# EAGLE design Barmaley (EAGLE 7.5.0)
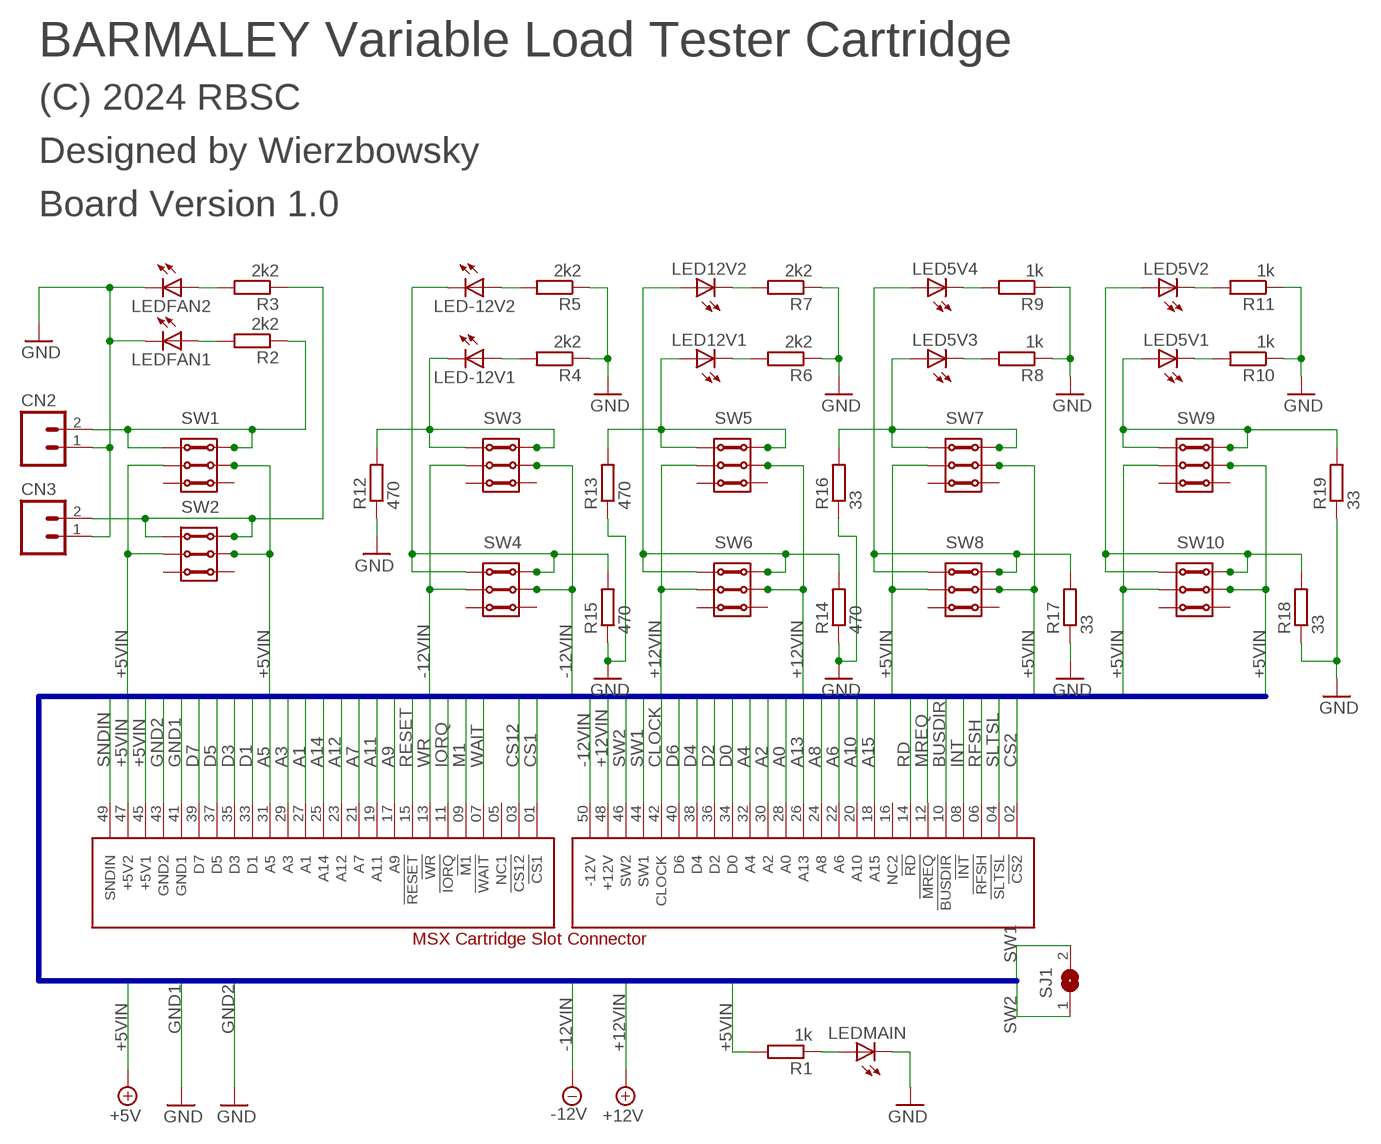
[diagram p0: schematic, sheet 1]

## Parts
CN1  SLOTCONN  MSX_SLOT_CON  [MSX_SLOT_CON]
CN2  2-PIN_FAN_CONNECTOR  [MOLEX-X2]
CN3  2-PIN_FAN_CONNECTOR  [MOLEX-X2]
LED5V1  LEDSQR2X5  [LED2X5]
LED5V2  LEDSQR2X5  [LED2X5]
LED5V3  LEDSQR2X5  [LED2X5]
LED5V4  LEDSQR2X5  [LED2X5]
LED12V1  LEDSQR2X5  [LED2X5]
LED12V2  LEDSQR2X5  [LED2X5]
LED-12V1  LEDSQR2X5  [LED2X5]
LED-12V2  LEDSQR2X5  [LED2X5]
LEDFAN1  LEDSQR2X5  [LED2X5]
LEDFAN2  LEDSQR2X5  [LED2X5]
LEDMAIN  LED5MM  [LED5MM]
R1  1k  R-EU_R0805  [R0805]
R2  2k2  R-EU_R0805  [R0805]
R3  2k2  R-EU_R0805  [R0805]
R4  2k2  R-EU_R0805  [R0805]
R5  2k2  R-EU_R0805  [R0805]
R6  2k2  R-EU_R0805  [R0805]
R7  2k2  R-EU_R0805  [R0805]
R8  1k  R-EU_R0805  [R0805]
R9  1k  R-EU_R0805  [R0805]
R10  1k  R-EU_R0805  [R0805]
R11  1k  R-EU_R0805  [R0805]
R12  470  R-EU_0617/22  [0617/22]
R13  470  R-EU_0617/22  [0617/22]
R14  470  R-EU_0617/22  [0617/22]
R15  470  R-EU_0617/22  [0617/22]
R16  33  R-EU_0617/22  [0617/22]
R17  33  R-EU_0617/22  [0617/22]
R18  33  R-EU_0617/22  [0617/22]
R19  33  R-EU_0617/22  [0617/22]
SJ1  SJ  [SJ]
SW1  2-POSITION_SWITCH  [2PSW]
SW2  2-POSITION_SWITCH  [2PSW]
SW3  2-POSITION_SWITCH  [2PSW]
SW4  2-POSITION_SWITCH  [2PSW]
SW5  2-POSITION_SWITCH  [2PSW]
SW6  2-POSITION_SWITCH  [2PSW]
SW7  2-POSITION_SWITCH  [2PSW]
SW8  2-POSITION_SWITCH  [2PSW]
SW9  2-POSITION_SWITCH  [2PSW]
SW10  2-POSITION_SWITCH  [2PSW]

## Nets
+5VIN: CN1.45(+5V1) CN1.47(+5V2) R1.2 SW1.2.1 SW1.2.2 SW2.2.1 SW2.2.2 SW7.2.1 SW7.2.2 SW8.2.1 SW8.2.2 SW9.2.1 SW9.2.2 SW10.2.1 SW10.2.2 ; supply symbol labelled +5V
+12VIN: CN1.48(+12V) SW5.2.1 SW5.2.2 SW6.2.1 SW6.2.2 ; supply symbol labelled +12V
-12VIN: CN1.50(-12V) SW3.2.1 SW3.2.2 SW4.2.1 SW4.2.2 ; supply symbol labelled -12V
A0: CN1.28(A0)
A1: CN1.27(A1)
A2: CN1.30(A2)
A3: CN1.29(A3)
A4: CN1.32(A4)
A5: CN1.31(A5)
A6: CN1.22(A6)
A7: CN1.21(A7)
A8: CN1.24(A8)
A9: CN1.17(A9)
A10: CN1.20(A10)
A11: CN1.19(A11)
A12: CN1.23(A12)
A13: CN1.26(A13)
A14: CN1.25(A14)
A15: CN1.18(A15)
BUSDIR: CN1.10(!BUSDIR)
CLOCK: CN1.42(CLOCK)
CS1: CN1.01(!CS1)
CS2: CN1.02(!CS2)
CS12: CN1.03(!CS12)
D0: CN1.34(D0)
D1: CN1.33(D1)
D2: CN1.36(D2)
D3: CN1.35(D3)
D4: CN1.38(D4)
D5: CN1.37(D5)
D6: CN1.40(D6)
D7: CN1.39(D7)
GND: CN2.1 CN3.1 LEDFAN1.K(C) LEDFAN2.K(C) LEDMAIN.K(C) R4.1 R5.1 R6.1 R7.1 R8.1 R9.1 R10.1 R11.1 R12.1 R13.1 R14.1 R15.1 R16.1 R17.1 R18.1 R19.1
GND1: CN1.41(GND1) ; supply symbol labelled GND
GND2: CN1.43(GND2) ; supply symbol labelled GND
GND3: LED-12V1.K(C) R12.2 SW3.3.1 SW3.3.2
GND4: LED-12V2.K(C) R15.2 SW4.3.1 SW4.3.2
INT: CN1.08(!INT)
IORQ: CN1.11(!IORQ)
M1: CN1.09(!M1)
MREQ: CN1.12(!MREQ)
N$1: LEDMAIN.A R1.1
N$2: CN2.2 R2.1 SW1.3.1 SW1.3.2
N$4: CN3.2 R3.1 SW2.3.1 SW2.3.2
N$5: LEDFAN1.A R2.2
N$6: LEDFAN2.A R3.2
N$7: LED-12V1.A R4.2
N$8: LED-12V2.A R5.2
N$9: LED12V1.K(C) R6.2
N$10: LED12V2.K(C) R7.2
N$11: LED5V4.K(C) R9.2
N$12: LED5V3.K(C) R8.2
N$13: LED5V1.K(C) R10.2
N$14: LED5V2.K(C) R11.2
N$15: LED12V1.A R13.2 SW5.3.1 SW5.3.2
N$16: LED12V2.A R14.2 SW6.3.1 SW6.3.2
N$19: LED5V4.A R17.2 SW8.3.1 SW8.3.2
N$21: LED5V3.A R16.2 SW7.3.1 SW7.3.2
N$22: LED5V1.A R19.2 SW9.3.1 SW9.3.2
N$24: LED5V2.A R18.2 SW10.3.1 SW10.3.2
RD: CN1.14(!RD)
RESET: CN1.15(!RESET)
RFSH: CN1.06(!RFSH)
SLTSL: CN1.04(!SLTSL)
SNDIN: CN1.49(SNDIN)
SW1: CN1.44(SW1) SJ1.2
SW2: CN1.46(SW2) SJ1.1
WAIT: CN1.07(!WAIT)
WR: CN1.13(!WR)
Unconnected: CN1.05(NC1) CN1.16(NC2) SW1.1.1 SW1.1.2 SW2.1.1 SW2.1.2 SW3.1.1 SW3.1.2 SW4.1.1 SW4.1.2 SW5.1.1 SW5.1.2 SW6.1.1 SW6.1.2 SW7.1.1 SW7.1.2 SW8.1.1 SW8.1.2 SW9.1.1 SW9.1.2 SW10.1.1 SW10.1.2

## Buses
D0,D1,D2,D3,D4,D5,D6,D7,A0,A1,A2,A3,A4,A5,A6,A7,A8,A9,A10,A11,A12,A13,A14,A15,SLTSL,RFSH,WAIT,INT,M1,BUSDIR,IORQ,MERQ,WR,RD,RESET,GND,CLOCK,SW1,SW2,CS1,CS2,CS12,SNDIN,GND1,GND2,+5V1,+5V2,+12V,-12V,+5VIN,+5VOUT,+12VIN,+12VOUT,-12VIN,-12VOUT,MREQ

## Notes on the sheet
- BARMALEY Variable Load Tester Cartridge
- (C) 2024 RBSC
- Designed by Wierzbowsky
- Board Version 1.0

## Library data of the parts
CN1 = msx_edge_conn:MSX_SLOT_CON
CN2 CN3 = fan_conn:2-PIN_FAN_CONNECTOR: 2-pin fan connector
LED5V1-LED5V4 LED12V1 LED12V2 LED-12V1 LED-12V2 LEDFAN1 LEDFAN2 LEDMAIN = led:LED: LED OSRAM: - CHIPLED LG R971, LG N971, LY N971, LG Q971, LY Q971, LO R971, LY R971 LH N974, LH R974 LS Q976, LO Q976, LY Q976 LO Q996 - Hyper CHIPLED LW Q18S LB Q993, LB Q99A, LB R99A - SideLED LS A670, LO A670, LY A670, LG A670, LP A670 LB A673, LV A673, LT A673, LW A673 LH A674 LY A675 LS A676, LA A676, LO A676, LY A676, LW A676 LS A679, LY A679, LG A679 - Hyper Micro SIDELED® LS Y876, LA Y876, LO Y876, LY Y876 LT Y87S - SmartLED LW L88C, LW L88S LB L89C, LB L89S, LG L890 LS L89K, LO L89K, LY L89K LS L896, LA L896, LO L896, LY L896 - TOPLED LS T670, LO T670, LY T670, LG T670, LP T670 LSG T670, LSP T670, LSY T670, LOP T670, LYG T670 LG T671, LOG T671, LSG T671 LB T673, LV T673, LT T673, LW T673 LH T674 LS T676, LA T676, LO T676, LY T676, LB T676, LH T676, LSB T676, LW T676 LB T67C, LV T67C, LT T67C, LS T67K, LO T67K, LY T67K, LW E67C LS E67B, LA E67B, LO E67B, LY E67B, LB E67C, LV E67C, LT E67C LW T67C LS T679, LY T679, LG T679 LS T770, LO T770, LY T770, LG T770, LP T770 LB T773, LV T773, LT T773, LW T773 LH T774 LS E675, LA E675, LY E675, LS T675 LS T776, LA T776, LO T776, LY T776, LB T776 LHGB T686 LT T68C, LB T68C - Hyper Mini TOPLED® LB M676 - Mini TOPLED Santana® LG M470 LS M47K, LO M47K, LY M47K Source: http://www.osram.convergy.de LUXEON: - LUMILED® LXK2-PW12-R00, LXK2-PW12-S00, LXK2-PW14-U00, LXK2-PW14-V00 LXK2-PM12-R00, LXK2-PM12-S00, LXK2-PM14-U00 LXK2-PE12-Q00, LXK2-PE12-R00, LXK2-PE12-S00, LXK2-PE14-T00, LXK2-PE14-U00 LXK2-PB12-K00, LXK2-PB12-L00, LXK2-PB12-M00, LXK2-PB14-N00, LXK2-PB14-P00, LXK2-PB14-Q00 LXK2-PR12-L00, LXK2-PR12-M00, LXK2-PR14-Q00, LXK2-PR14-R00 LXK2-PD12-Q00, LXK2-PD12-R00, LXK2-PD12-S00 LXK2-PH12-R00, LXK2-PH12-S00 LXK2-PL12-P00, LXK2-PL12-Q00, LXK2-PL12-R00 Source: www.luxeon.com KINGBRIGHT: KA-3528ASYC Source: www.kingbright.com
R1-R19 = resistor:R-EU_: RESISTOR, European symbol
SJ1 = jumper:SJ: SMD solder JUMPER
SW1-SW10 = 2pos_switch:2-POSITION_SWITCH: 2-Position DIP switch

## Board
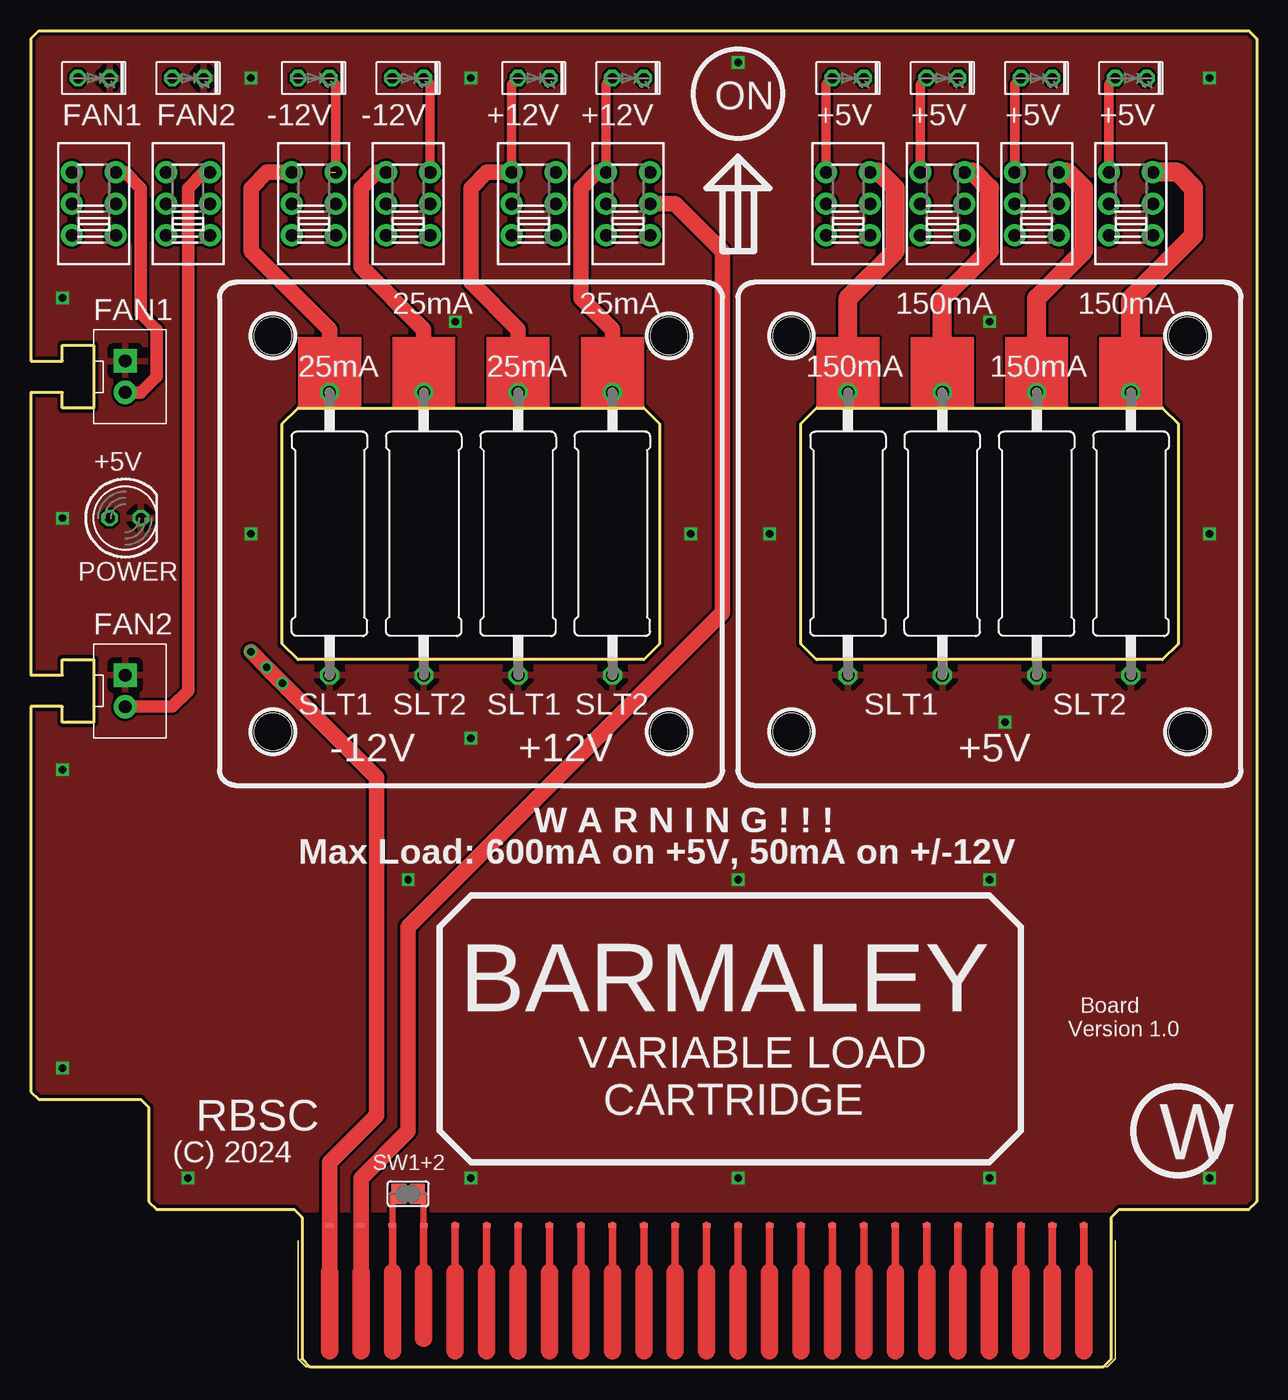
[diagram p1: board, top side]
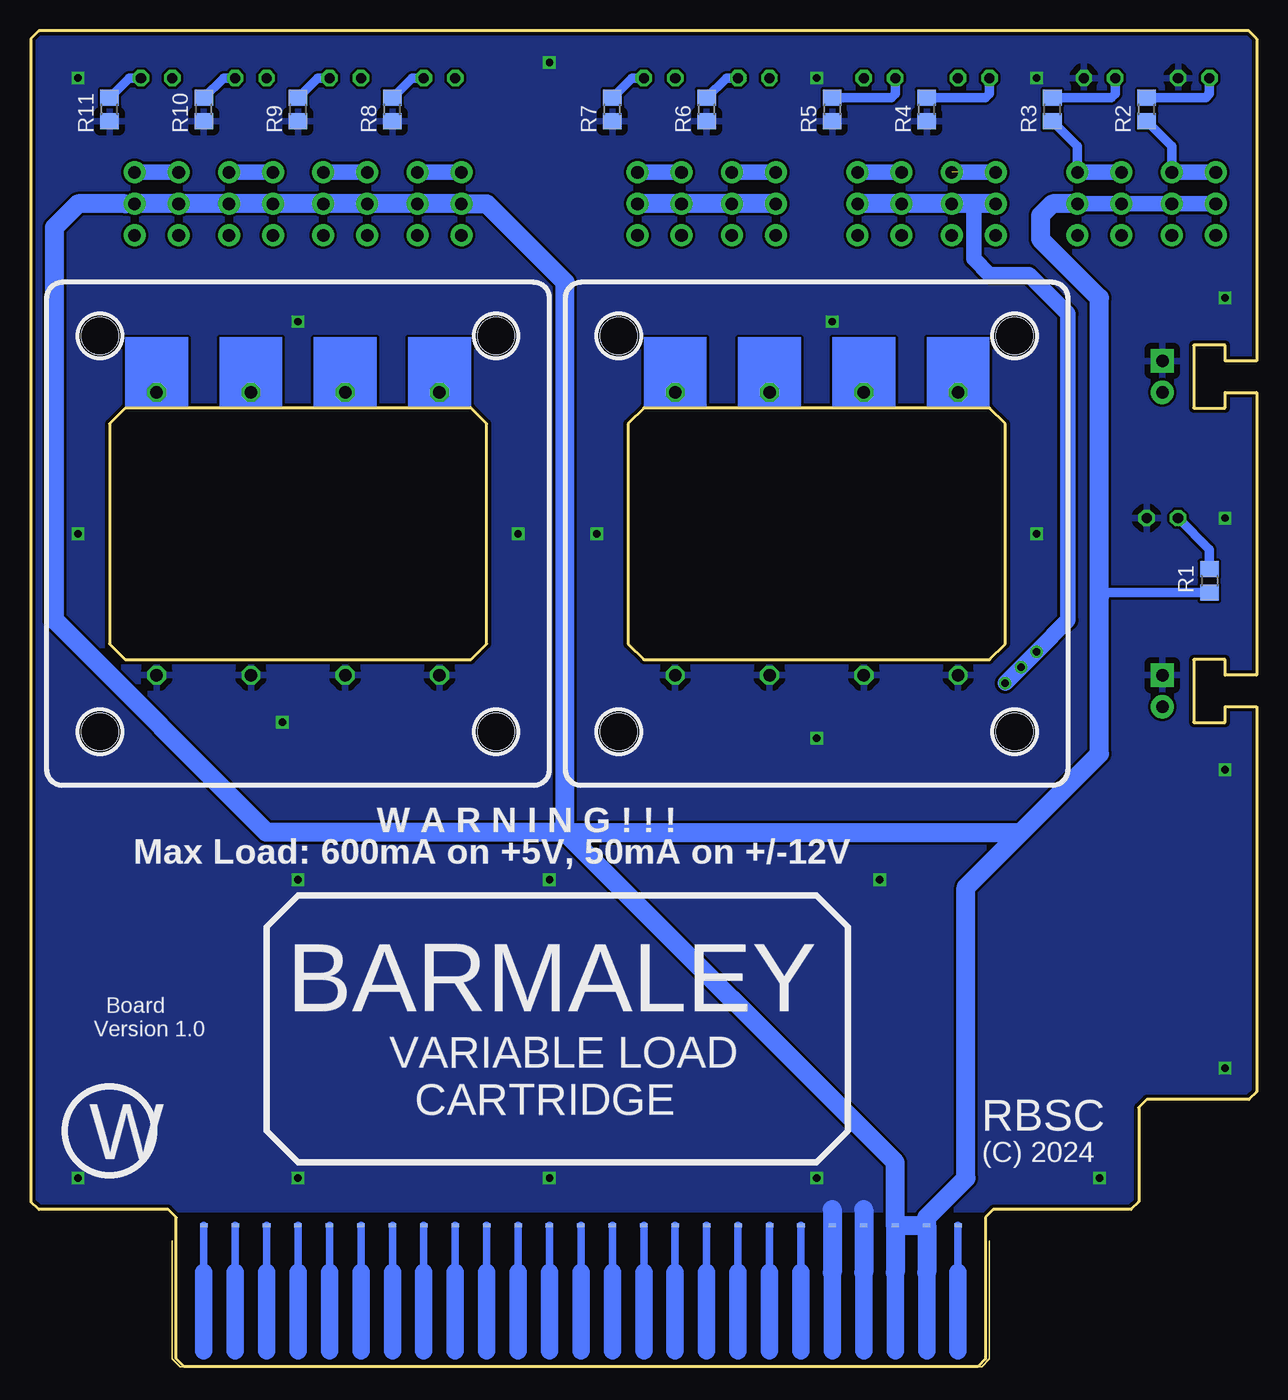
[diagram p2: board, bottom side, seen from below]

Size 99.06 x 107.95 mm. Coordinates in mm from the lower left corner, seen from the top.
Outline: 87.95,12.7 98.42,12.7 99.06,13.34 99.06,107.31 98.42,107.95 0.64,107.95 0,107.31 0,81.28 2.54,81.28 2.54,82.55 5.08,82.55 5.08,77.47 2.54,77.47 2.54,78.74 0,78.74 0,55.88 2.54,55.88 2.54,57.15 5.08,57.15 5.08,52.07 2.54,52.07 2.54,53.34 0,53.34 0,22.23 0.64,21.59 8.89,21.59 9.53,20.95 9.53,13.34 10.16,12.7 21.27,12.7 21.91,12.06 21.91,0.64 22.54,0 86.68,0 87.31,0.64 87.31,12.06 87.95,12.7
Outline: 21.59,77.47 49.53,77.47 50.8,76.2 50.8,58.42 49.53,57.15 21.59,57.15 20.32,58.42 20.32,76.2 21.59,77.47
Outline: 63.5,77.47 91.44,77.47 92.71,76.2 92.71,58.42 91.44,57.15 63.5,57.15 62.23,58.42 62.23,76.2 63.5,77.47
Copper layers (1*16): Top 0.035mm / dielectric 1.5mm / Bottom 0.035mm
Design rules "default *": minimum track width 10mil, minimum drill 24mil, track to track 8mil, track to pad 8mil, pad to pad 8mil, via to via 8mil, smd to smd 8mil, copper to edge 10mil, drill to drill 8mil, minimum pad ring 10mil, minimum via ring 8mil, stop-mask expansion 4mil, vias tented up to drill 25mil, thermal gap 20mil
Holes 3 mm at 61.47,51.31 93.47,51.31 93.47,83.31 61.47,83.31 19.56,51.31 51.56,51.31 51.56,83.31 19.56,83.31

### Footprints (pad centres in the part's own frame; a part is rotated, then mirrored left to right if it is on the bottom)
MSX_SLOT_CON = smd 0.61 x 0.305 bottom: 01 30.48,11.43; 03 27.94,11.43; 05 25.4,11.43; 07 22.86,11.43; 09 20.32,11.43; 11 17.78,11.43; 13 15.24,11.43; 15 12.7,11.43; 17 10.16,11.43; 19 7.62,11.43; 21 5.08,11.43; 23 2.54,11.43; 25 0,11.43; 27 -2.54,11.43; 29 -5.08,11.43; 31 -7.62,11.43; 33 -10.16,11.43; 35 -12.7,11.43; 37 -15.24,11.43; 39 -17.78,11.43; 41 -20.32,11.43; 43 -22.86,11.43; 45 -25.4,11.43; 47 -27.94,11.43; 49 -30.48,11.43 | smd 0.61 x 0.305: 02 30.48,11.43; 04 27.94,11.43; 06 25.4,11.43; 08 22.86,11.43; 10 20.32,11.43; 12 17.78,11.43; 14 15.24,11.43; 16 12.7,11.43; 18 10.16,11.43; 20 7.62,11.43; 22 5.08,11.43; 24 2.54,11.43; 26 0,11.43; 28 -2.54,11.43; 30 -5.08,11.43; 32 -7.62,11.43; 34 -10.16,11.43; 36 -12.7,11.43; 38 -15.24,11.43; 40 -17.78,11.43; 42 -20.32,11.43; 44 -22.86,11.43; 46 -25.4,11.43; 48 -27.94,11.43; 50 -30.48,11.43
MOLEX-X2 = drill 1.016 pad 1.88 square: 1 2.54,2.54 | drill 1.016 pad 1.88: 2 5.08,2.54
LED2X5 = drill 0.813 octagon: A -1.27,0; K 1.27,0
LED5MM = drill 0.813 octagon: A -1.27,0; K 1.27,0
R0805 = smd 1.3 x 1.5: 1 -0.95,0; 2 0.95,0
0617/22 = drill 1.016 octagon: 1 -11.43,0; 2 11.43,0
SJ = smd 1.168 x 1.6: 1 -0.762,0; 2 0.762,0
2PSW = drill 1.016 pad 1.778: 1.1 -2.54,1.778; 1.2 -2.54,-1.778; 2.1 0,1.778; 2.2 0,-1.778; 3.1 2.54,1.778; 3.2 2.54,-1.778

### Placement (x,y rotation side)
CN1  54.61,0 0 top
CN2  5.08,83.82 270 top
CN3  5.08,58.42 270 top
LED5V1  81.28,104.14 0 top
LED5V2  88.9,104.14 0 top
LED5V3  66.04,104.14 0 top
LED5V4  73.66,104.14 0 top
LED12V1  40.64,104.14 0 top
LED12V2  48.26,104.14 0 top
LED-12V1  22.86,104.14 0 top
LED-12V2  30.48,104.14 0 top
LEDFAN1  5.08,104.14 0 top
LEDFAN2  12.7,104.14 0 top
LEDMAIN  7.62,68.58 0 top
R1  3.81,63.5 270 bottom
R2  8.89,101.6 90 bottom
R3  16.51,101.6 90 bottom
R4  26.67,101.6 90 bottom
R5  34.29,101.6 90 bottom
R6  44.45,101.6 90 bottom
R7  52.07,101.6 90 bottom
R8  69.85,101.6 90 bottom
R9  77.47,101.6 90 bottom
R10  85.09,101.6 90 bottom
R11  92.71,101.6 90 bottom
R12  24.13,67.31 90 top
R13  39.37,67.31 90 top
R14  46.99,67.31 90 top
R15  31.75,67.31 90 top
R16  66.04,67.31 90 top
R17  73.66,67.31 90 top
R18  88.9,67.31 90 top
R19  81.28,67.31 90 top
SJ1  30.48,13.97 0 top
SW1  5.08,93.98 90 top
SW2  12.7,93.98 90 top
SW3  22.86,93.98 90 top
SW4  30.48,93.98 90 top
SW5  40.64,93.98 90 top
SW6  48.26,93.98 90 top
SW7  66.04,93.98 90 top
SW8  73.66,93.98 90 top
SW9  81.28,93.98 90 top
SW10  88.9,93.98 90 top

### Tracks (layer width: path | path; a pad name or v marks a point on that pad's centre or on a via)
+5VIN
  Bottom 0.762: R1.2 12.38,62.55 12.7,62.23
  Bottom 1.27: SW2.2.2 SW2.2.1 SW1.2.2 SW1.2.1
  Bottom 1.524: CN1.47 26.67,12.06 23.5,15.24 23.5,38.73 19.05,43.18 | CN1.45 29.21,7.62 | CN1.45 CN1.47 | CN1.47 26.67,7.62 | CN1.45 29.21,16.51 55.88,43.18 | 55.88,43.18 55.88,87.63 62.23,93.98 SW7.2.1 SW7.2.2 SW8.2.1 SW8.2.2 SW9.2.1 SW9.2.2 SW10.2.1 SW10.2.2 | 19.05,43.18 12.7,49.53 12.7,62.23 12.7,86.36 17.46,91.12 17.46,93.03 16.51,93.98 SW2.2.2 | 55.88,43.18 80.01,43.18 97.16,60.33 97.16,92.08 95.25,93.98 91.44,93.98 | 55.88,43.18 19.05,43.18
+12VIN
  Top 1.27: CN1.48 26.67,7.62 26.67,15.24 30.48,19.05 30.48,35.56 55.88,60.96 55.88,90.17 52.07,93.98 SW6.2.2
  Bottom 1.524: SW5.2.1 SW5.2.2 SW6.2.1 SW6.2.2
-12VIN  (via drill 0.6)
  Top 1.27: 24.13,7.62 CN1.50 24.13,16.51 27.94,20.32 27.94,47.62 v20.32,55.24 v19.05,56.52 v17.78,57.78
  Bottom 1.27: v20.32,55.24 v17.78,57.78 15.24,60.33 15.24,85.09 18.41,88.27 21.59,88.27 22.86,89.53 22.86,93.98
  Bottom 1.524: SW3.2.1 22.86,93.98 SW3.2.2 SW4.2.1 SW4.2.2
CLOCK
  Top 0.254: 33.71,1.14 34.29,1.27
GND  (via drill 0.6)
  Bottom 1.524: 34.29,12.7 34.29,7.62 | 31.75,12.7 31.75,7.62
  other vias: 2.54,24.13 12.7,15.24 57.15,15.24 95.25,15.24 95.25,104.14 53.34,67.31 59.69,67.31 95.25,67.31 17.78,67.31 2.54,86.36 2.54,68.58 2.54,48.26 57.15,105.41 35.56,104.14 34.29,84.45 77.47,84.45 35.56,15.24 77.47,15.24 77.47,39.37 57.15,39.37 30.48,39.37 78.74,52.07 35.56,50.8 17.78,104.14
  pour Top: 0,107.95 99.06,107.95 99.06,12.7 10.16,12.7 8.89,12.7 8.89,21.59 0,21.59
  pour Bottom: 0,107.95 99.06,107.95 99.06,12.7 8.89,12.7 8.89,21.59 0,21.59
GND2
  Bottom 0.254: 31.65,10.52 31.75,7.62
GND3  (1 unrouted)
  Top 0.762: SW3.3.2 24.64,103.63 LED-12V1.K
  Top 1.27: R12.2 24.13,83.82 17.78,90.17 17.78,95.25 19.05,96.52 SW3.3.1
  Bottom 1.27: SW3.3.1 24.13,96.52
GND4
  Top 0.762: SW4.3.2 32.26,103.63 LED-12V2.K
  Top 1.27: R15.2 31.75,83.82 26.67,88.9 26.67,95.25 27.94,96.52 SW4.3.1
  Bottom 1.27: SW4.3.1 SW4.3.2
N$1
  Bottom 0.762: R1.1 3.81,66.04 LEDMAIN.A
N$2
  Top 1.016: SW1.3.2 7.62,96.52 8.89,95.25 8.89,85.09 10.16,83.82 10.16,80.01 8.89,78.74 CN2.2
  Bottom 0.762: SW1.3.2 6.86,98.62 R2.1
  Bottom 1.27: SW1.3.1 SW1.3.2
N$4
  Top 1.016: CN3.2 11.43,53.34 12.7,54.61 12.7,95.25 13.97,96.52 SW2.3.2
  Bottom 0.762: SW2.3.2 14.48,98.62 R3.1
  Bottom 1.27: SW2.3.1 SW2.3.2
N$5
  Bottom 0.762: R2.2 4.13,102.55 3.81,102.87 LEDFAN1.A
N$6
  Bottom 0.762: R3.2 11.75,102.55 11.43,102.87 LEDFAN2.A
N$7
  Bottom 0.762: R4.2 21.91,102.55 21.59,102.87 LED-12V1.A
N$8
  Bottom 0.762: R5.2 29.53,102.55 29.21,102.87 LED-12V2.A
N$9
  Bottom 0.762: LED12V1.K 42.86,104.14 R6.2
N$10
  Bottom 0.762: LED12V2.K 50.48,104.14 R7.2
N$11
  Bottom 0.762: LED5V4.K 75.88,104.14 R9.2
N$12
  Bottom 0.762: LED5V3.K 68.26,104.14 R8.2
N$13
  Bottom 0.762: LED5V1.K 83.5,104.14 R10.2
N$14
  Bottom 0.762: LED5V2.K 91.12,104.14 R11.2
N$15
  Top 0.762: SW5.3.1 38.86,103.63 LED12V1.A
  Top 1.27: R13.2 39.37,83.82 35.56,87.63 35.56,95.25 36.83,96.52 SW5.3.1
  Bottom 1.27: SW5.3.1 SW5.3.2
N$16
  Top 0.762: SW6.3.1 46.48,103.63 LED12V2.A
  Top 1.27: R14.2 46.99,83.82 44.45,86.36 44.45,95.25 45.72,96.52 SW6.3.1
  Bottom 1.27: SW6.3.1 SW6.3.2
N$19
  Top 0.762: SW8.3.1 71.88,103.63 LED5V4.A
  Top 1.524: R17.2 73.66,86.36 77.47,90.17 77.47,95.25 76.2,96.52 SW8.3.2
  Bottom 1.27: SW8.3.1 SW8.3.2
N$21
  Top 0.762: SW7.3.1 64.26,103.63 LED5V3.A
  Top 1.524: R16.2 66.04,86.36 69.85,90.17 69.85,95.25 68.58,96.52 SW7.3.2
  Bottom 1.27: SW7.3.1 SW7.3.2
N$22
  Top 0.762: SW9.3.1 79.5,103.63 LED5V1.A
  Top 1.524: R19.2 81.28,86.36 85.09,90.17 85.09,95.25 83.82,96.52 SW9.3.2
  Bottom 1.27: SW9.3.1 SW9.3.2
N$24
  Top 0.762: SW10.3.1 87.12,103.63 LED5V2.A
  Top 1.524: R18.2 88.9,86.36 93.98,91.44 93.98,95.25 92.71,96.52 SW10.3.2
  Bottom 1.27: SW10.3.1 SW10.3.2
SW1
  Top 0.508: SJ1.2 31.75,13.97 CN1.44
SW2
  Top 0.508: SJ1.1 29.21,13.97 CN1.46
(copper drawn outside any net)
  shapes: Bottom area x11, Top area x8

### Text on the board
tNames: ON | FAN1 | FAN2 | -12V | -12V | +12V | +12V | +5V | +5V | +5V | +5V | FAN1 | 25mA | 25mA | 150mA | 150mA | 25mA | 25mA | 150mA | 150mA | +5V | POWER | FAN2 | SLT1 | SLT2 | SLT1 | SLT2 | SLT1 | SLT2 | -12V | +12V | +5V | W A R N I N G ! ! ! | Max Load: 600mA on +5V, 50mA on +/-12V | BARMALEY | VARIABLE LOAD | Board / Version 1.0 | CARTRIDGE | RBSC | (C) 2024 | W | SW1+2
bNames: W A R N I N G ! ! ! | Max Load: 600mA on +5V, 50mA on +/-12V | BARMALEY | VARIABLE LOAD | Board / Version 1.0 | CARTRIDGE | RBSC | (C) 2024 | W